# Altium schematic sheet InputOutput.SchDoc
size A2
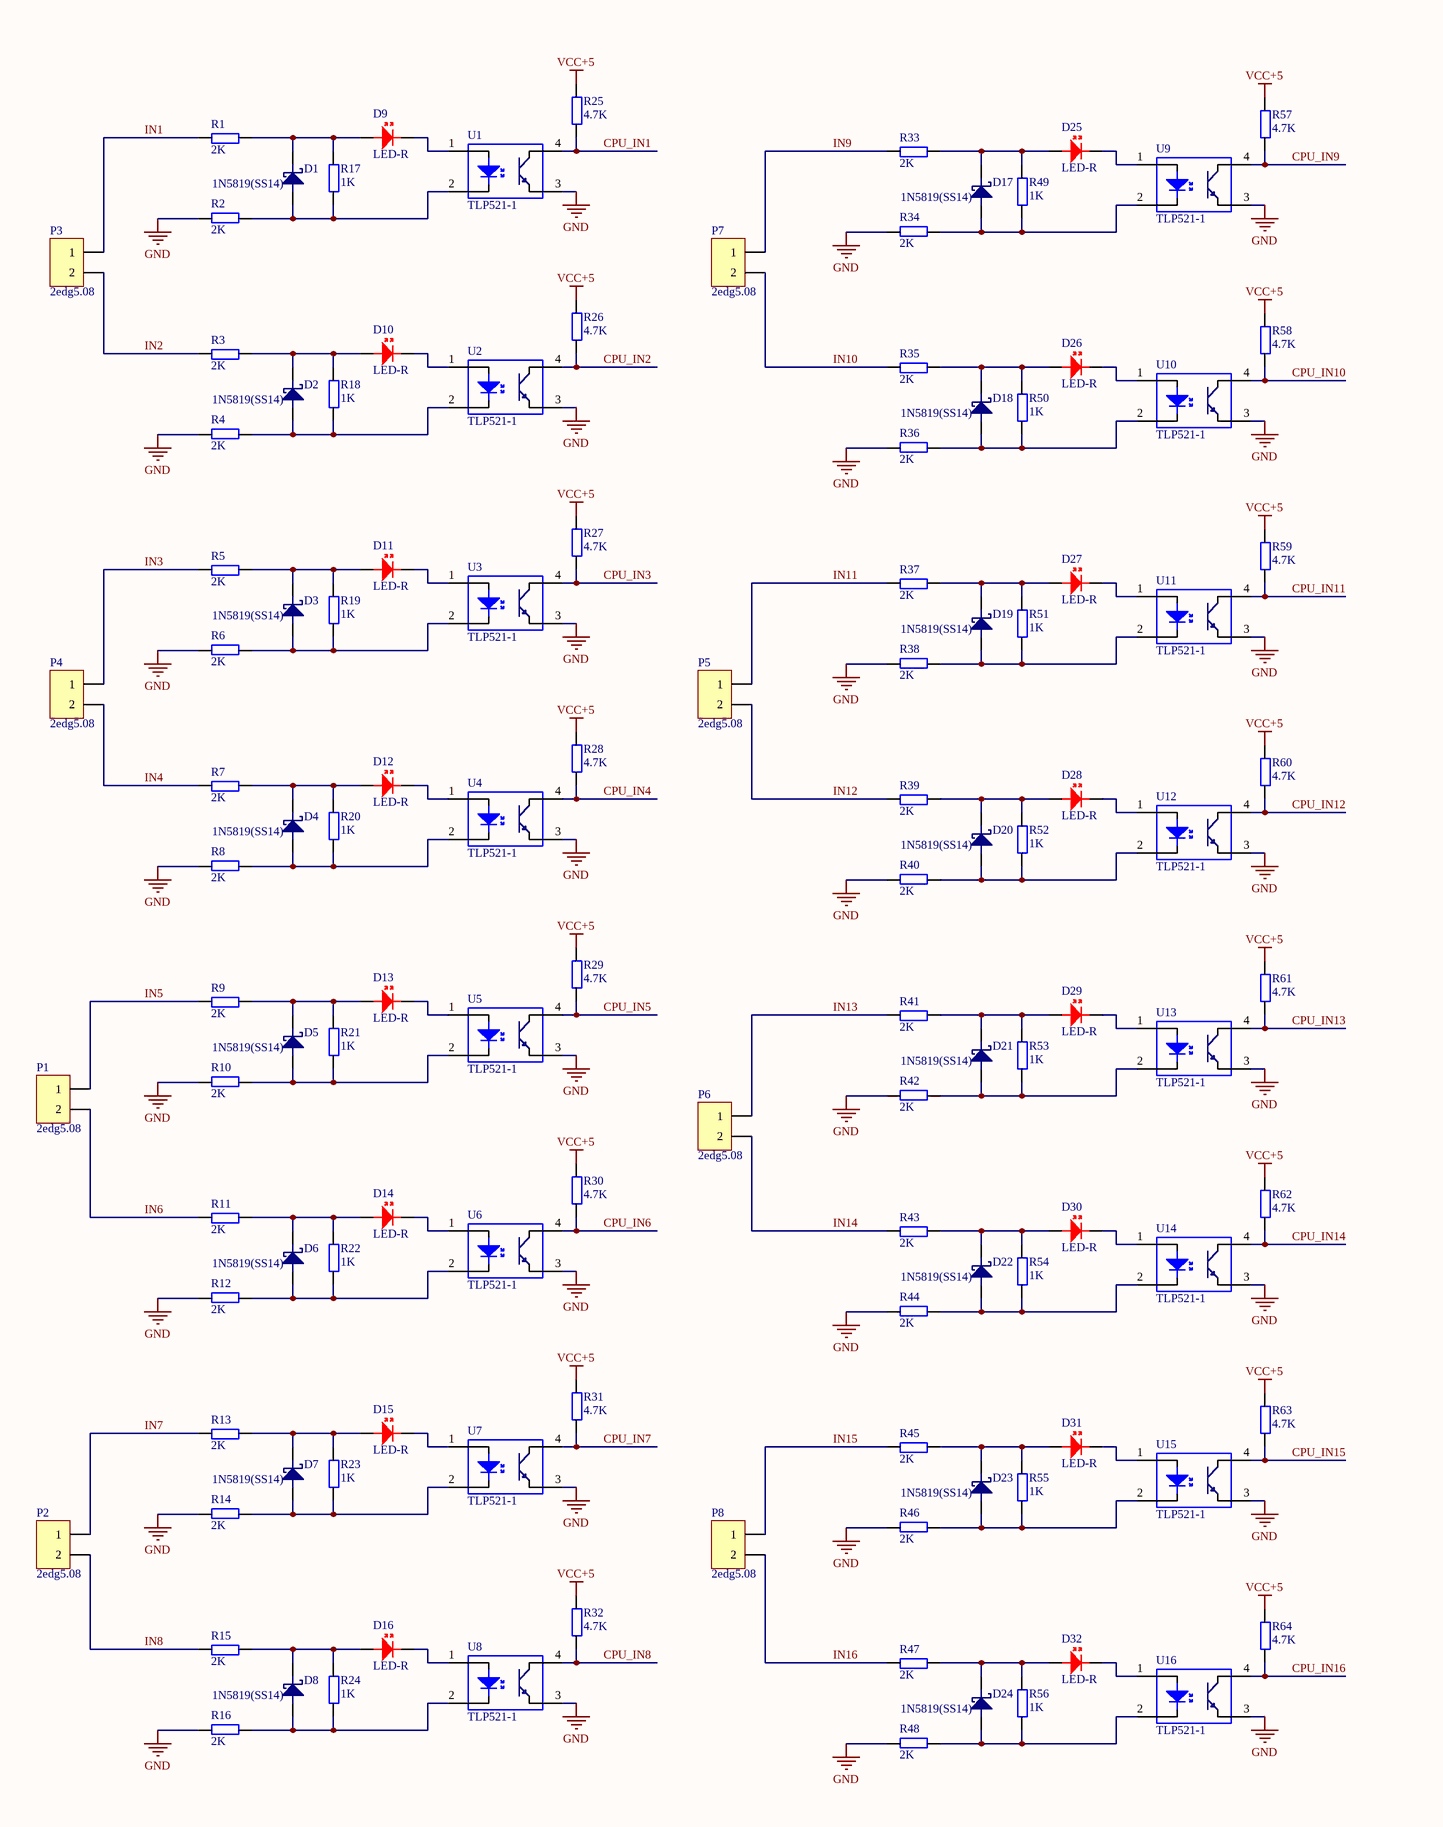
[diagram p0: InputOutput.SchDoc, left]
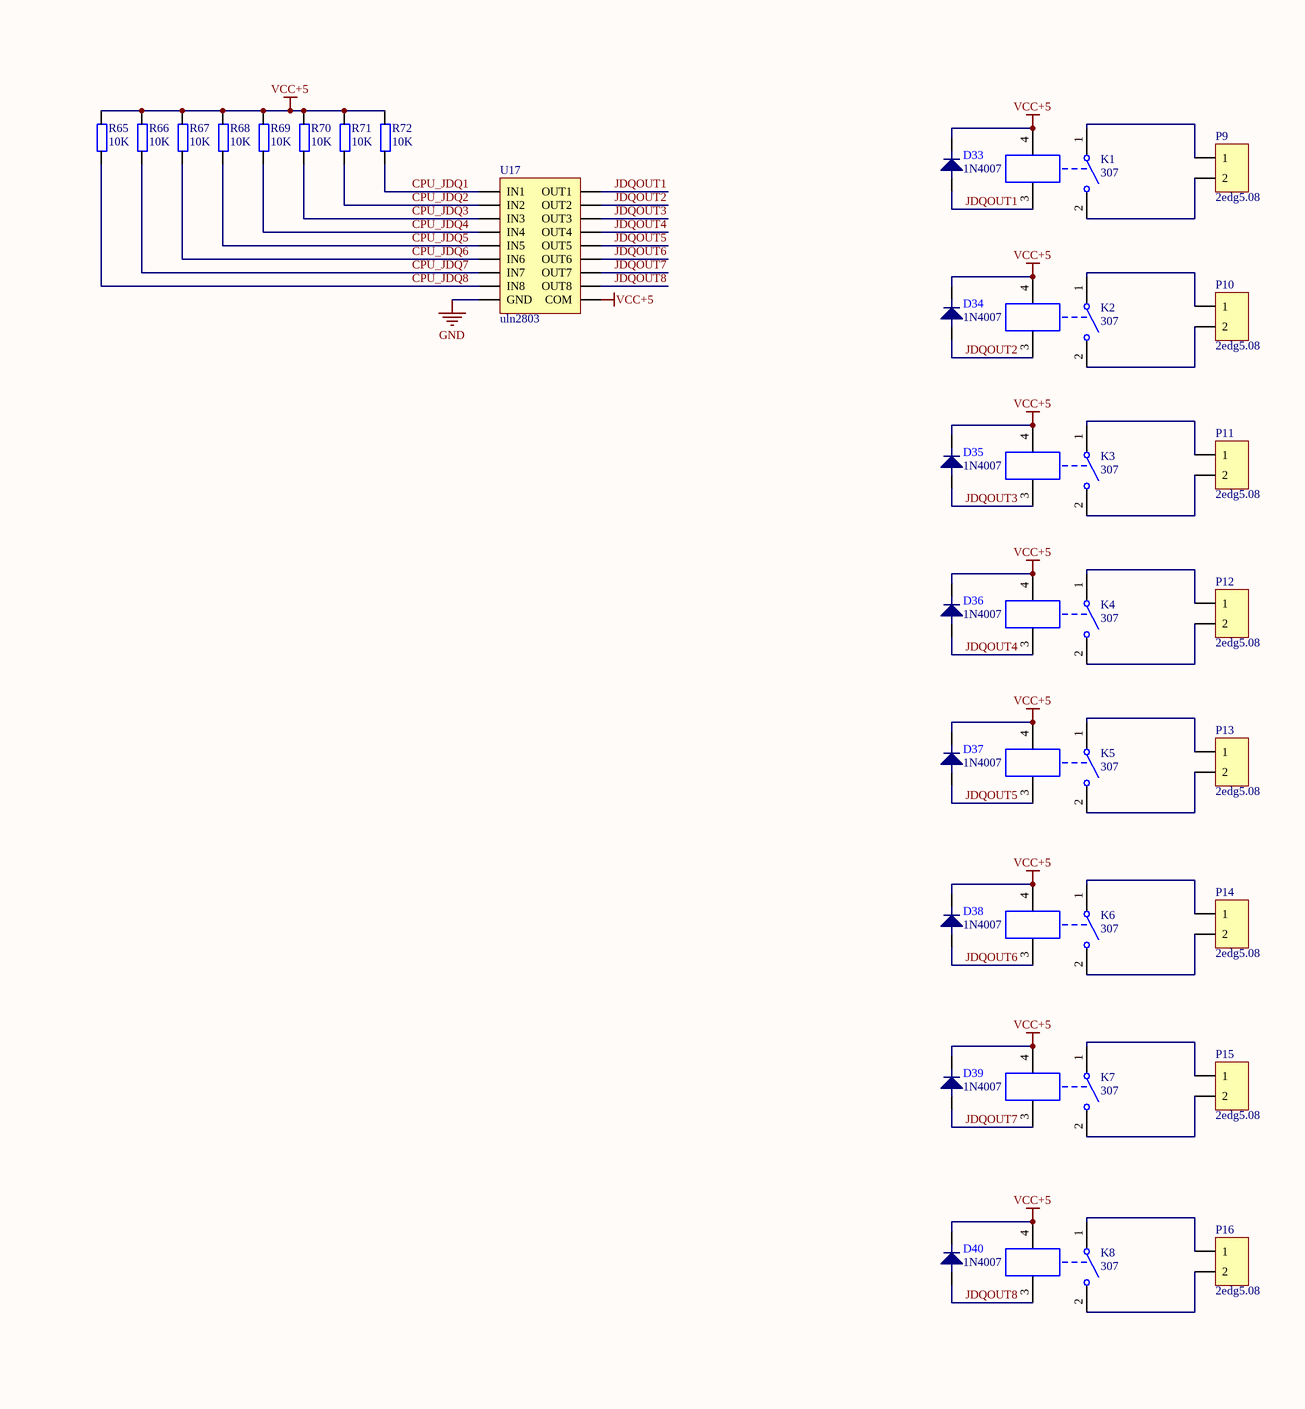
[diagram p1: InputOutput.SchDoc, right]

## Parts
D1  1N5819(SS14)  [DO-214AC(SMA)]
D2  1N5819(SS14)  [DO-214AC(SMA)]
D3  1N5819(SS14)  [DO-214AC(SMA)]
D4  1N5819(SS14)  [DO-214AC(SMA)]
D5  1N5819(SS14)  [DO-214AC(SMA)]
D6  1N5819(SS14)  [DO-214AC(SMA)]
D7  1N5819(SS14)  [DO-214AC(SMA)]
D8  1N5819(SS14)  [DO-214AC(SMA)]
D9  LED-R  [0805-LED]
D10  LED-R  [0805-LED]
D11  LED-R  [0805-LED]
D12  LED-R  [0805-LED]
D13  LED-R  [0805-LED]
D14  LED-R  [0805-LED]
D15  LED-R  [0805-LED]
D16  LED-R  [0805-LED]
D17  1N5819(SS14)  [DO-214AC(SMA)]
D18  1N5819(SS14)  [DO-214AC(SMA)]
D19  1N5819(SS14)  [DO-214AC(SMA)]
D20  1N5819(SS14)  [DO-214AC(SMA)]
D21  1N5819(SS14)  [DO-214AC(SMA)]
D22  1N5819(SS14)  [DO-214AC(SMA)]
D23  1N5819(SS14)  [DO-214AC(SMA)]
D24  1N5819(SS14)  [DO-214AC(SMA)]
D25  LED-R  [0805-LED]
D26  LED-R  [0805-LED]
D27  LED-R  [0805-LED]
D28  LED-R  [0805-LED]
D29  LED-R  [0805-LED]
D30  LED-R  [0805-LED]
D31  LED-R  [0805-LED]
D32  LED-R  [0805-LED]
D33  1N4007  [DO-214AC(SMA)]
D34  1N4007  [DO-214AC(SMA)]
D35  1N4007  [DO-214AC(SMA)]
D36  1N4007  [DO-214AC(SMA)]
D37  1N4007  [DO-214AC(SMA)]
D38  1N4007  [DO-214AC(SMA)]
D39  1N4007  [DO-214AC(SMA)]
D40  1N4007  [DO-214AC(SMA)]
K1  307  [RELAY-SONGCHUAN]
K2  307  [RELAY-SONGCHUAN]
K3  307  [RELAY-SONGCHUAN]
K4  307  [RELAY-SONGCHUAN]
K5  307  [RELAY-SONGCHUAN]
K6  307  [RELAY-SONGCHUAN]
K7  307  [RELAY-SONGCHUAN]
K8  307  [RELAY-SONGCHUAN]
P1  2edg5.08  [2edg5.08_2]
P2  2edg5.08  [2edg5.08_2]
P3  2edg5.08  [2edg5.08_2]
P4  2edg5.08  [2edg5.08_2]
P5  2edg5.08  [2edg5.08_2]
P6  2edg5.08  [2edg5.08_2]
P7  2edg5.08  [2edg5.08_2]
P8  2edg5.08  [2edg5.08_2]
P9  2edg5.08  [2edg5.08_2]
P10  2edg5.08  [2edg5.08_2]
P11  2edg5.08  [2edg5.08_2]
P12  2edg5.08  [2edg5.08_2]
P13  2edg5.08  [2edg5.08_2]
P14  2edg5.08  [2edg5.08_2]
P15  2edg5.08  [2edg5.08_2]
P16  2edg5.08  [2edg5.08_2]
R1  2K  [0805-RES]
R2  2K  [0805-RES]
R3  2K  [0805-RES]
R4  2K  [0805-RES]
R5  2K  [0805-RES]
R6  2K  [0805-RES]
R7  2K  [0805-RES]
R8  2K  [0805-RES]
R9  2K  [0805-RES]
R10  2K  [0805-RES]
R11  2K  [0805-RES]
R12  2K  [0805-RES]
R13  2K  [0805-RES]
R14  2K  [0805-RES]
R15  2K  [0805-RES]
R16  2K  [0805-RES]
R17  1K  [0805-RES]
R18  1K  [0805-RES]
R19  1K  [0805-RES]
R20  1K  [0805-RES]
R21  1K  [0805-RES]
R22  1K  [0805-RES]
R23  1K  [0805-RES]
R24  1K  [0805-RES]
R25  4.7K  [0805-RES]
R26  4.7K  [0805-RES]
R27  4.7K  [0805-RES]
R28  4.7K  [0805-RES]
R29  4.7K  [0805-RES]
R30  4.7K  [0805-RES]
R31  4.7K  [0805-RES]
R32  4.7K  [0805-RES]
R33  2K  [0805-RES]
R34  2K  [0805-RES]
R35  2K  [0805-RES]
R36  2K  [0805-RES]
R37  2K  [0805-RES]
R38  2K  [0805-RES]
R39  2K  [0805-RES]
R40  2K  [0805-RES]
R41  2K  [0805-RES]
R42  2K  [0805-RES]
R43  2K  [0805-RES]
R44  2K  [0805-RES]
R45  2K  [0805-RES]
R46  2K  [0805-RES]
R47  2K  [0805-RES]
R48  2K  [0805-RES]
R49  1K  [0805-RES]
R50  1K  [0805-RES]
R51  1K  [0805-RES]
R52  1K  [0805-RES]
R53  1K  [0805-RES]
R54  1K  [0805-RES]
R55  1K  [0805-RES]
R56  1K  [0805-RES]
R57  4.7K  [0805-RES]
R58  4.7K  [0805-RES]
R59  4.7K  [0805-RES]
R60  4.7K  [0805-RES]
R61  4.7K  [0805-RES]
R62  4.7K  [0805-RES]
R63  4.7K  [0805-RES]
R64  4.7K  [0805-RES]
R65  10K  [0805-RES]
R66  10K  [0805-RES]
R67  10K  [0805-RES]
R68  10K  [0805-RES]
R69  10K  [0805-RES]
R70  10K  [0805-RES]
R71  10K  [0805-RES]
R72  10K  [0805-RES]
U1  TLP521-1  [DIP4]
U2  TLP521-1  [DIP4]
U3  TLP521-1  [DIP4]
U4  TLP521-1  [DIP4]
U5  TLP521-1  [DIP4]
U6  TLP521-1  [DIP4]
U7  TLP521-1  [DIP4]
U8  TLP521-1  [DIP4]
U9  TLP521-1  [DIP4]
U10  TLP521-1  [DIP4]
U11  TLP521-1  [DIP4]
U12  TLP521-1  [DIP4]
U13  TLP521-1  [DIP4]
U14  TLP521-1  [DIP4]
U15  TLP521-1  [DIP4]
U16  TLP521-1  [DIP4]
U17  uln2803  [SOP18]

## Nets
GND: R2.2 R4.2 R6.2 R8.2 R10.2 R12.2 R14.2 R16.2 R34.2 R36.2 R38.2 R40.2 R42.2 R44.2 R46.2 R48.2 U1.3 U2.3 U3.3 U4.3 U5.3 U6.3 U7.3 U8.3 U9.3 U10.3 U11.3 U12.3 U13.3 U14.3 U15.3 U16.3 U17.9(GND)
VCC+5: D33.2 D34.2 D35.2 D36.2 D37.2 D38.2 D39.2 D40.2 K1.4 K2.4 K3.4 K4.4 K5.4 K6.4 K7.4 K8.4 R25.2 R26.2 R27.2 R28.2 R29.2 R30.2 R31.2 R32.2 R57.2 R58.2 R59.2 R60.2 R61.2 R62.2 R63.2 R64.2 R65.2 R66.2 R67.2 R68.2 R69.2 R70.2 R71.2 R72.2 U17.10(COM)
CPU_IN1: R25.1 U1.4
CPU_IN2: R26.1 U2.4
CPU_IN3: R27.1 U3.4
CPU_IN4: R28.1 U4.4
CPU_IN5: R29.1 U5.4
CPU_IN6: R30.1 U6.4
CPU_IN7: R31.1 U7.4
CPU_IN8: R32.1 U8.4
CPU_IN9: R57.1 U9.4
CPU_IN10: R58.1 U10.4
CPU_IN11: R59.1 U11.4
CPU_IN12: R60.1 U12.4
CPU_IN13: R61.1 U13.4
CPU_IN14: R62.1 U14.4
CPU_IN15: R63.1 U15.4
CPU_IN16: R64.1 U16.4
CPU_JDQ1: R72.1 U17.1(IN1)
CPU_JDQ2: R71.1 U17.2(IN2)
CPU_JDQ3: R70.1 U17.3(IN3)
CPU_JDQ4: R69.1 U17.4(IN4)
CPU_JDQ5: R68.1 U17.5(IN5)
CPU_JDQ6: R67.1 U17.6(IN6)
CPU_JDQ7: R66.1 U17.7(IN7)
CPU_JDQ8: R65.1 U17.17(IN8)
IN1: P3.1 R1.1
IN2: P3.2 R3.1
IN3: P4.1 R5.1
IN4: P4.2 R7.1
IN5: P1.1 R9.1
IN6: P1.2 R11.1
IN7: P2.1 R13.1
IN8: P2.2 R15.1
IN9: P7.1 R33.1
IN10: P7.2 R35.1
IN11: P5.1 R37.1
IN12: P5.2 R39.1
IN13: P6.1 R41.1
IN14: P6.2 R43.1
IN15: P8.1 R45.1
IN16: P8.2 R47.1
JDQOUT1: D33.1 K1.3 U17.18(OUT1)
JDQOUT2: D34.1 K2.3 U17.17(OUT2)
JDQOUT3: D35.1 K3.3 U17.16(OUT3)
JDQOUT4: D36.1 K4.3 U17.15(OUT4)
JDQOUT5: D37.1 K5.3 U17.14(OUT5)
JDQOUT6: D38.1 K6.3 U17.13(OUT6)
JDQOUT7: D39.1 K7.3 U17.12(OUT7)
JDQOUT8: D40.1 K8.3 U17.11(OUT8)
NetD1_1: D1.1 R2.1 R17.1 U1.2
NetD1_2: D1.2 D9.1 R1.2 R17.2
NetD2_1: D2.1 R4.1 R18.1 U2.2
NetD2_2: D2.2 D10.1 R3.2 R18.2
NetD3_1: D3.1 R6.1 R19.1 U3.2
NetD3_2: D3.2 D11.1 R5.2 R19.2
NetD4_1: D4.1 R8.1 R20.1 U4.2
NetD4_2: D4.2 D12.1 R7.2 R20.2
NetD5_1: D5.1 R10.1 R21.1 U5.2
NetD5_2: D5.2 D13.1 R9.2 R21.2
NetD6_1: D6.1 R12.1 R22.1 U6.2
NetD6_2: D6.2 D14.1 R11.2 R22.2
NetD7_1: D7.1 R14.1 R23.1 U7.2
NetD7_2: D7.2 D15.1 R13.2 R23.2
NetD8_1: D8.1 R16.1 R24.1 U8.2
NetD8_2: D8.2 D16.1 R15.2 R24.2
NetD9_2: D9.2 U1.1
NetD10_2: D10.2 U2.1
NetD11_2: D11.2 U3.1
NetD12_2: D12.2 U4.1
NetD13_2: D13.2 U5.1
NetD14_2: D14.2 U6.1
NetD15_2: D15.2 U7.1
NetD16_2: D16.2 U8.1
NetD17_1: D17.1 R34.1 R49.1 U9.2
NetD17_2: D17.2 D25.1 R33.2 R49.2
NetD18_1: D18.1 R36.1 R50.1 U10.2
NetD18_2: D18.2 D26.1 R35.2 R50.2
NetD19_1: D19.1 R38.1 R51.1 U11.2
NetD19_2: D19.2 D27.1 R37.2 R51.2
NetD20_1: D20.1 R40.1 R52.1 U12.2
NetD20_2: D20.2 D28.1 R39.2 R52.2
NetD21_1: D21.1 R42.1 R53.1 U13.2
NetD21_2: D21.2 D29.1 R41.2 R53.2
NetD22_1: D22.1 R44.1 R54.1 U14.2
NetD22_2: D22.2 D30.1 R43.2 R54.2
NetD23_1: D23.1 R46.1 R55.1 U15.2
NetD23_2: D23.2 D31.1 R45.2 R55.2
NetD24_1: D24.1 R48.1 R56.1 U16.2
NetD24_2: D24.2 D32.1 R47.2 R56.2
NetD25_2: D25.2 U9.1
NetD26_2: D26.2 U10.1
NetD27_2: D27.2 U11.1
NetD28_2: D28.2 U12.1
NetD29_2: D29.2 U13.1
NetD30_2: D30.2 U14.1
NetD31_2: D31.2 U15.1
NetD32_2: D32.2 U16.1
NetK1_1: K1.1 P9.1
NetK1_2: K1.2 P9.2
NetK2_1: K2.1 P10.1
NetK2_2: K2.2 P10.2
NetK3_1: K3.1 P11.1
NetK3_2: K3.2 P11.2
NetK4_1: K4.1 P12.1
NetK4_2: K4.2 P12.2
NetK5_1: K5.1 P13.1
NetK5_2: K5.2 P13.2
NetK6_1: K6.1 P14.1
NetK6_2: K6.2 P14.2
NetK7_1: K7.1 P15.1
NetK7_2: K7.2 P15.2
NetK8_1: K8.1 P16.1
NetK8_2: K8.2 P16.2

## Library data of the parts
D1-D8 D17-D24 = 1N5819(SS14): 肖特基二极管
D9-D16 D25-D32 = LED-RED: 红色LED
D33-D40 = 1N4007: 1A整流二极管
K1-K8 = JDQ_307: 继电器
P1-P16 = 2EDG5.08_2: 端子
R1-R72 = Res
U1-U16 = TLP521: 光耦